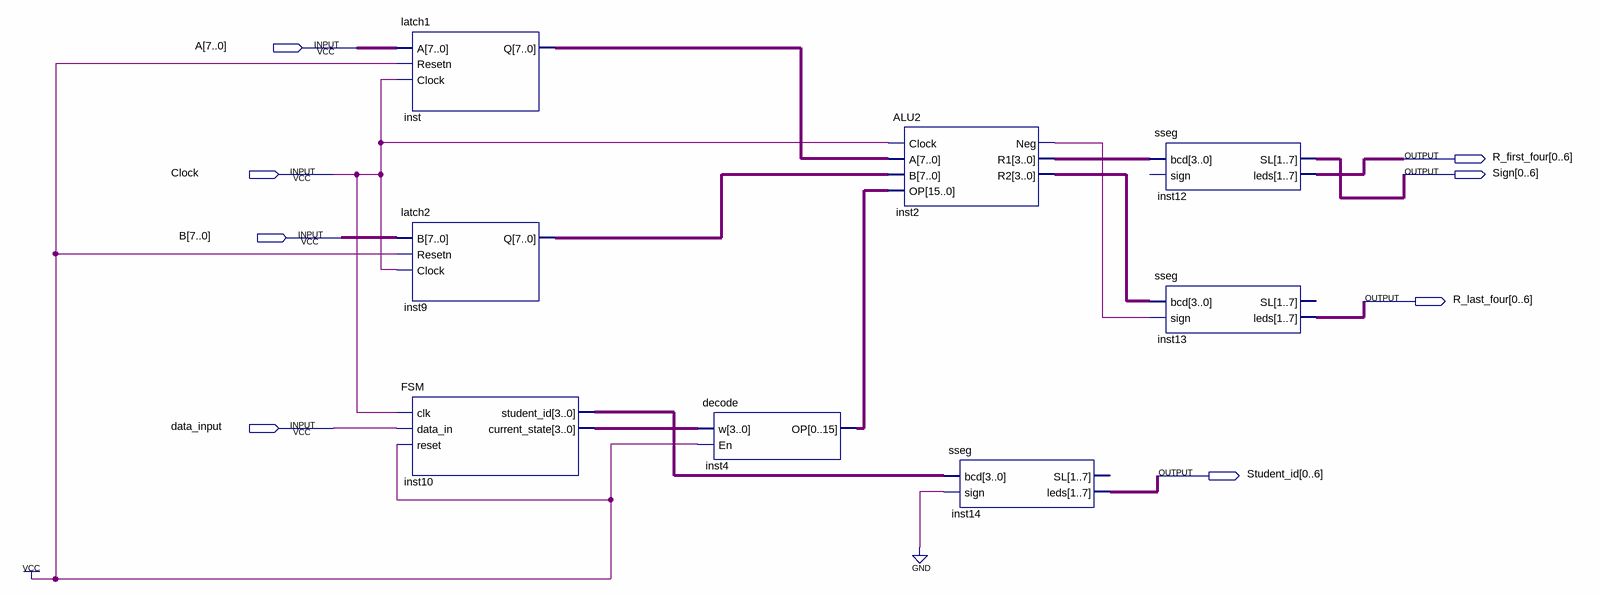
[diagram p0: schematic sheet]
// Quartus schematic ALU_2.bdf as structural Verilog: 8 symbols, 8 pins
module ALU_2 (
  input  [7:0] A,
  input  Clock,
  input  [7:0] B,
  input  data_input,
  output [0:6] R_first_four,
  output [0:6] Sign,
  output [0:6] R_last_four,
  output [0:6] Student_id
);

  wire inst2_neg;
  wire [3:0] inst2_r1, inst2_r2, inst10_current_state, inst10_student_id;
  wire [7:0] inst9_q, inst_q;
  wire [15:0] inst4_op;

  latch1 inst (.A(A), .Resetn(1'b1), .Clock(Clock), .Q(inst_q));
  latch2 inst9 (.B(B), .Resetn(1'b1), .Clock(Clock), .Q(inst9_q));
  FSM inst10 (
    .clk(Clock), .data_in(data_input), .reset(1'b1), .student_id(inst10_student_id),
    .current_state(inst10_current_state));
  decode inst4 (.w(inst10_current_state), .En(1'b1), .OP(inst4_op));
  ALU2 inst2 (.Clock(Clock), .A(inst_q), .B(inst9_q), .OP(inst4_op), .Neg(inst2_neg), .R1(inst2_r1), .R2(inst2_r2));
  sseg inst14 (.bcd(inst10_student_id), .sign(1'b0), .leds(Student_id));  // open: SL
  sseg inst12 (.bcd(inst2_r1), .SL(Sign), .leds(R_first_four));  // open: sign
  sseg inst13 (.bcd(inst2_r2), .sign(inst2_neg), .leds(R_last_four));  // open: SL
endmodule
